# EAGLE schematic V9938 (EAGLE 6.4)
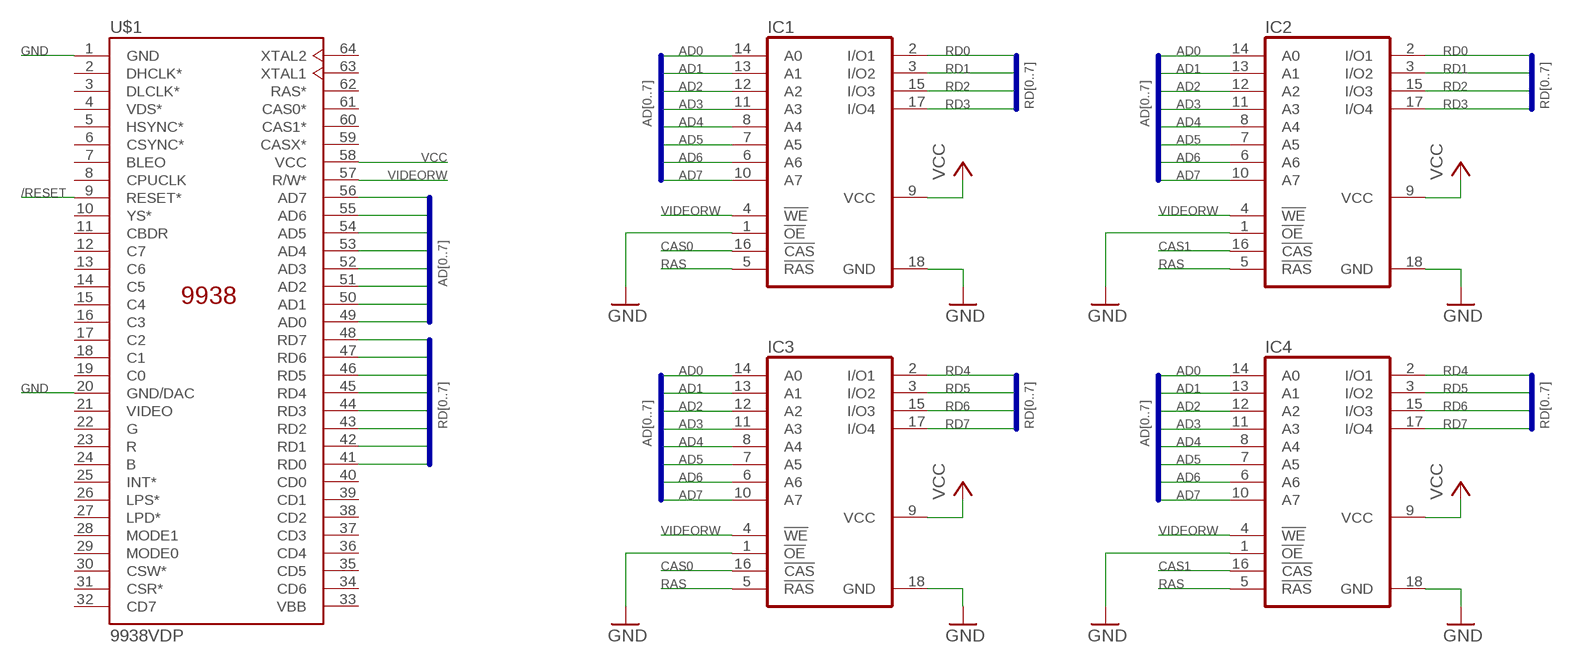
[diagram p0: schematic, sheet 1]

## Parts
IC1  41464C  [DIL18]
IC2  41464C  [DIL18]
IC3  41464C  [DIL18]
IC4  41464C  [DIL18]
U$1  9938VDP  [DIL64-600]

## Nets
/RESET: U$1.9(RESET*)
AD0: IC1.14(A0) IC2.14(A0) IC3.14(A0) IC4.14(A0) U$1.49(AD0)
AD1: IC1.13(A1) IC2.13(A1) IC3.13(A1) IC4.13(A1) U$1.50(AD1)
AD2: IC1.12(A2) IC2.12(A2) IC3.12(A2) IC4.12(A2) U$1.51(AD2)
AD3: IC1.11(A3) IC2.11(A3) IC3.11(A3) IC4.11(A3) U$1.52(AD3)
AD4: IC1.8(A4) IC2.8(A4) IC3.8(A4) IC4.8(A4) U$1.53(AD4)
AD5: IC1.7(A5) IC2.7(A5) IC3.7(A5) IC4.7(A5) U$1.54(AD5)
AD6: IC1.6(A6) IC2.6(A6) IC3.6(A6) IC4.6(A6) U$1.55(AD6)
AD7: IC1.10(A7) IC2.10(A7) IC3.10(A7) IC4.10(A7) U$1.56(AD7)
CAS0: IC1.16(!CAS) IC3.16(!CAS)
CAS1: IC2.16(!CAS) IC4.16(!CAS)
GND: IC1.1(!OE) IC1.18(GND) IC2.1(!OE) IC2.18(GND) IC3.1(!OE) IC3.18(GND) IC4.1(!OE) IC4.18(GND) U$1.1(GND) U$1.20(GND/DAC)
RAS: IC1.5(!RAS) IC2.5(!RAS) IC3.5(!RAS) IC4.5(!RAS)
RD0: IC1.2(I/O1) IC2.2(I/O1) U$1.41(RD0)
RD1: IC1.3(I/O2) IC2.3(I/O2) U$1.42(RD1)
RD2: IC1.15(I/O3) IC2.15(I/O3) U$1.43(RD2)
RD3: IC1.17(I/O4) IC2.17(I/O4) U$1.44(RD3)
RD4: IC3.2(I/O1) IC4.2(I/O1) U$1.45(RD4)
RD5: IC3.3(I/O2) IC4.3(I/O2) U$1.46(RD5)
RD6: IC3.15(I/O3) IC4.15(I/O3) U$1.47(RD6)
RD7: IC3.17(I/O4) IC4.17(I/O4) U$1.48(RD7)
VCC: IC1.9(VCC) IC2.9(VCC) IC3.9(VCC) IC4.9(VCC) U$1.58(VCC)
VIDEORW: IC1.4(!WE) IC2.4(!WE) IC3.4(!WE) IC4.4(!WE) U$1.57(R/W*)
Unconnected: U$1.2(DHCLK*) U$1.3(DLCLK*) U$1.4(VDS*) U$1.5(HSYNC*) U$1.6(CSYNC*) U$1.7(BLEO) U$1.8(CPUCLK) U$1.10(YS*) U$1.11(CBDR) U$1.12(C7) U$1.13(C6) U$1.14(C5) U$1.15(C4) U$1.16(C3) U$1.17(C2) U$1.18(C1) U$1.19(C0) U$1.21(VIDEO) U$1.22(G) U$1.23(R) U$1.24(B) U$1.25(INT*) U$1.26(LPS*) U$1.27(LPD*) U$1.28(MODE1) U$1.29(MODE0) U$1.30(CSW*) U$1.31(CSR*) U$1.32(CD7) U$1.33(VBB) U$1.34(CD6) U$1.35(CD5) U$1.36(CD4) U$1.37(CD3) U$1.38(CD2) U$1.39(CD1) U$1.40(CD0) U$1.59(CASX*) U$1.60(CAS1*) U$1.61(CAS0*) U$1.62(RAS*) U$1.63(XTAL1) U$1.64(XTAL2)

## Buses
AD[0..7]
RD[0..7]

## Library data of the parts
IC1-IC4 = memory-nec:41464C: MEMORY; OC_FARNELL: unknown; OC_NEWARK: unknown
U$1 = tms99xx_v2.0:9938VDP